# EAGLE design cubex_motherboard (EAGLE 6.5.0)
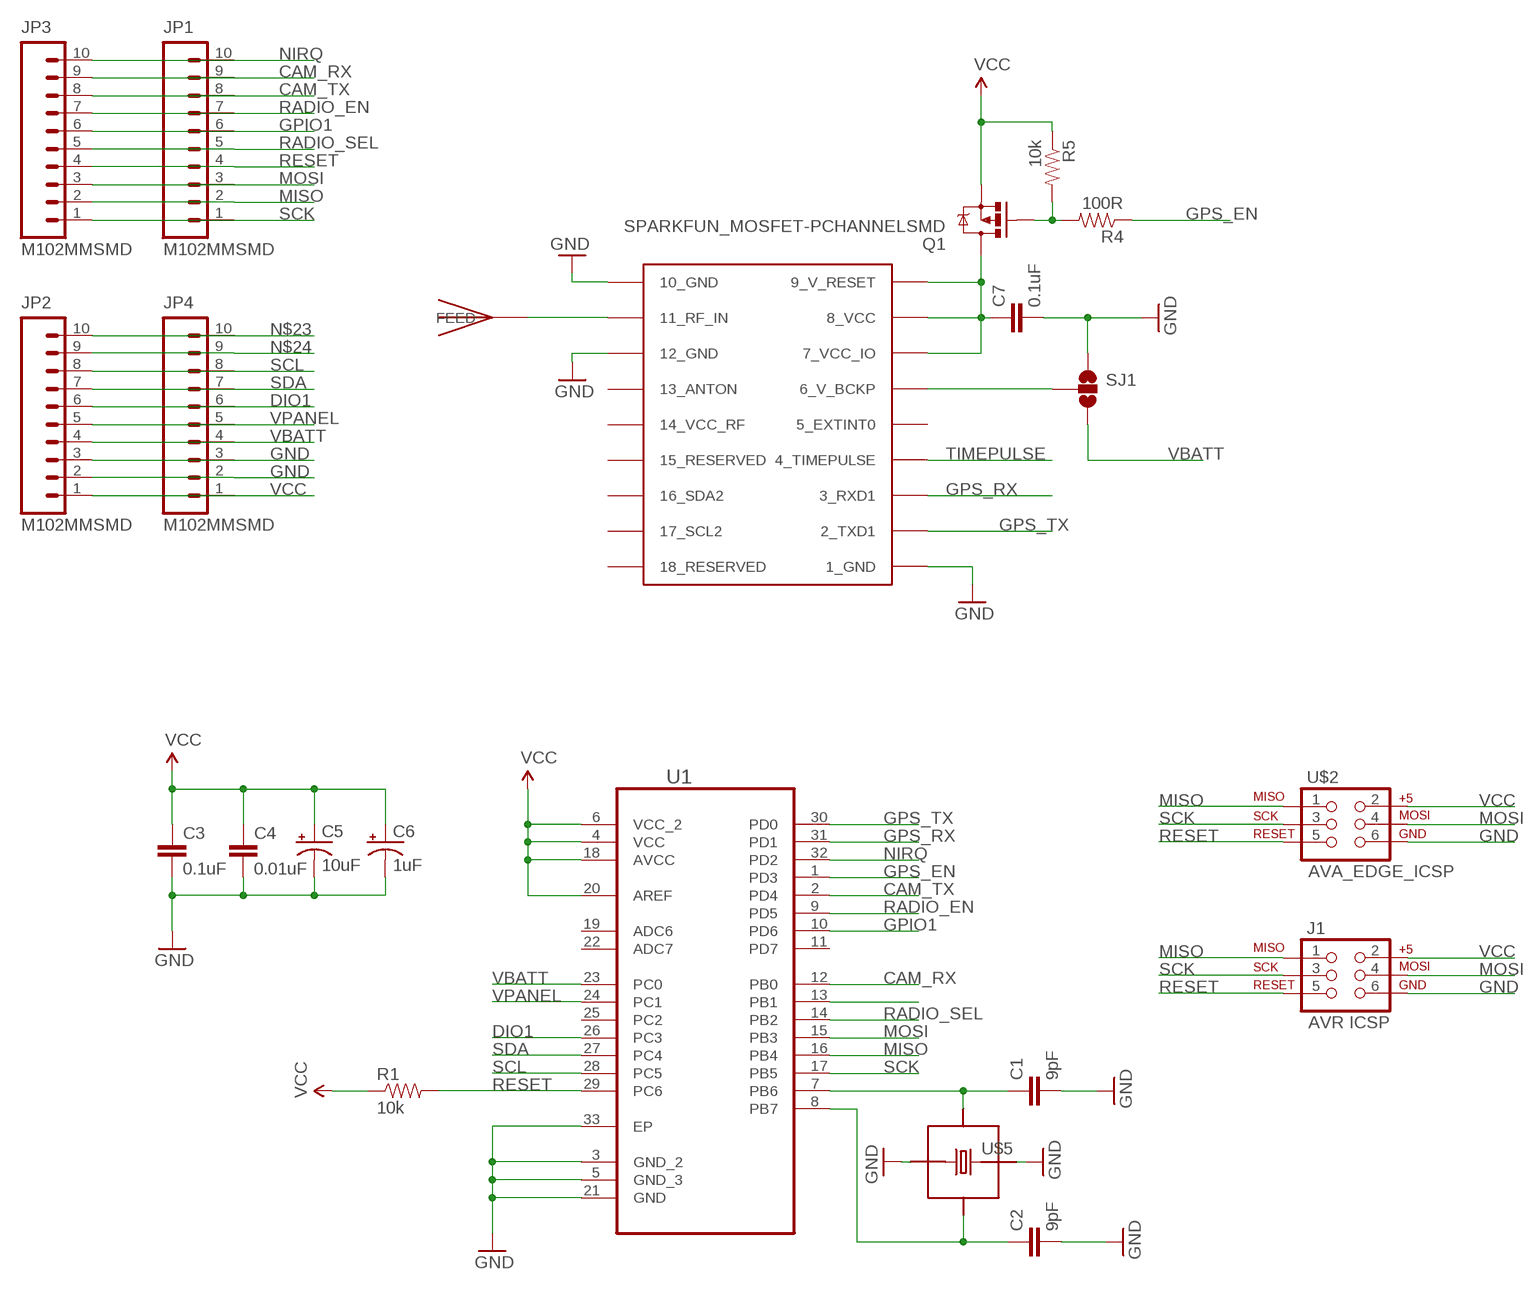
[diagram p0: schematic, sheet 1]

## Parts
C1  9pF  CAP0805  [0805]
C2  9pF  CAP0805  [0805]
C3  0.1uF  CAP0805  [0805]
C4  0.01uF  CAP0805  [0805]
C5  10uF  CAP_POL1206  [EIA3216]
C6  1uF  CAP_POL1206  [EIA3216]
C7  0.1uF  SPARKFUN_CAP0805  [SPARKFUN_0805]
J1  AVR ICSP  SPARKFUN_AVR_SPI_PRG_6NS  [SPARKFUN_2X3-NS]
JP1  M102MMSMD  [1X10-2MM-SMD]
JP2  M102MMSMD  [1X10-2MM-SMD]
JP3  M102MMSMD  [1X10-2MM-SMD]
JP4  M102MMSMD  [1X10-2MM-SMD]
Q1  SPARKFUN_MOSFET-PCHANNELSMD  [SPARKFUN_SOT23-3]
R1  10k  RESISTOR0805-RES  [0805]
R4  100R  SPARKFUN_RESISTOR0805-RES  [SPARKFUN_0805]
R5  10k  SPARKFUN_RESISTOR0805-RES  [SPARKFUN_0805]
SJ1  SPARKFUN_SOLDERJUMPER_2WAYT  [SPARKFUN_SJ_2]
U1  AVA_ATMEGA328P-MU  [AVA_QFN50P500X500X100-33N]
U$2  AVA_EDGE_ICSP  [AVA_EDGE_MOUNTED_ICSP]
U$3  AVA_JTI_ANTENNA-1575AT43A40  [AVA_JTI_ANTENNA-1575AT43A40]
U$4  AVA_UBLOX_MAX-6  [AVA_UBLOX_MAX-6]
U$5  AVA_EPSON_FA-20H_CRYSTAL  [AVA_EPSON-FA-20H-CRYSTAL]

## Nets
CAM_RX: JP1.9 JP3.9 U1.12(PB0)
CAM_TX: JP1.8 JP3.8 U1.2(PD4)
DIO1: JP2.6 JP4.6 U1.26(PC3)
GND: C1.2 C2.2 C3.2 C4.2 C5.C(-) C6.C(-) C7.2 J1.6 JP2.2 JP2.3 JP4.2 JP4.3 SJ1.1 U1.3(GND_2) U1.5(GND_3) U1.21(GND) U1.33(EP) U$2.6 U$4.1_GND U$4.10_GND U$4.12_GND U$5.1 U$5.3
GPIO1: JP1.6 JP3.6 U1.10(PD6)
GPS_EN: R4.1 U1.1(PD3)
GPS_RX: U1.31(PD1) U$4.3_RXD1
GPS_TX: U1.30(PD0) U$4.2_TXD1
MISO: J1.1 JP1.2 JP3.2 U1.16(PB4) U$2.1
MOSI: J1.4 JP1.3 JP3.3 U1.15(PB3) U$2.4
N$2: U1.13(PB1)
N$3: C7.1 Q1.3(D) U$4.7_VCC_IO U$4.8_VCC U$4.9_V_RESET
N$4: SJ1.2 U$4.6_V_BCKP
N$6: Q1.1(G) R4.2 R5.2
N$9: U$3.FEED U$4.11_RF_IN
N$10: C1.1 U1.7(PB6) U$5.4
N$11: C2.1 U1.8(PB7) U$5.2
N$23: JP2.10 JP4.10
N$24: JP2.9 JP4.9
NIRQ: JP1.10 JP3.10 U1.32(PD2)
RADIO_EN: JP1.7 JP3.7 U1.9(PD5)
RADIO_SEL: JP1.5 JP3.5 U1.14(PB2)
RESET: J1.5 JP1.4 JP3.4 R1.2 U1.29(PC6) U$2.5
SCK: J1.3 JP1.1 JP3.1 U1.17(PB5) U$2.3
SCL: JP2.8 JP4.8 U1.28(PC5)
SDA: JP2.7 JP4.7 U1.27(PC4)
TIMEPULSE: U$4.4_TIMEPULSE
VBATT: JP2.4 JP4.4 SJ1.3 U1.23(PC0)
VCC: C3.1 C4.1 C5.A(+) C6.A(+) J1.2 JP2.1 JP4.1 Q1.2(S) R1.1 R5.1 U1.4(VCC) U1.6(VCC_2) U1.18(AVCC) U1.20(AREF) U$2.2
VPANEL: JP2.5 JP4.5 U1.24(PC1)
Unconnected: U1.11(PD7) U1.19(ADC6) U1.22(ADC7) U1.25(PC2) U$4.5_EXTINT0 U$4.13_ANTON U$4.14_VCC_RF U$4.15_RESERVED U$4.16_SDA2 U$4.17_SCL2 U$4.18_RESERVED

## Library data of the parts
C1-C4 = SparkFun:CAP: Capacitor Standard 0603 ceramic capacitor, and 0.1" leaded capacitor.
C5 C6 = SparkFun:CAP_POL: Capacitor Polarized These are standard SMD and PTH capacitors. Normally 10uF, 47uF, and 100uF in electrolytic and tantalum varieties. Always verify the external diameter of the through hole cap, it varies with capacity, voltage, and manufacturer. The EIA devices should be standard.
C7 = picoAVA-R9:SPARKFUN_CAP: Capacitor Standard 0603 ceramic capacitor, and 0.1" leaded capacitor.
J1 = picoAVA-R8:SPARKFUN_AVR_SPI_PRG_6: AVR ISP 6 Pin This is the reduced ISP connector for AVR programming. Common on Arduino. This footprint will take up less PCB space and can be used with a 10-pin to 6-pin adapter such as SKU: BOB-08508
JP1-JP4 = SparkFun:M10: Header 10 Standard 10-pin 0.1" header. Use with straight break away headers (SKU : PRT-00116), right angle break away headers (PRT-00553), swiss pins (PRT-00743), machine pins (PRT-00117), and female headers (PRT-00115).
Q1 = picoAVA-R9:SPARKFUN_MOSFET-PCHANNEL
R1 = SparkFun:RESISTOR: Resistor Basic schematic elements and footprints for 0603, 1206, and PTH resistors.
R4 R5 = picoAVA-R9:SPARKFUN_RESISTOR: Resistor Basic schematic elements and footprints for 0603, 1206, and PTH resistors.
SJ1 = picoAVA-R9:SPARKFUN_SOLDERJUMPER_2WAY: Solder Jumper 2 way solder jumper
U1 = picoAVA-R8:AVA_ATMEGA328P-MU: Programmable Flash; MPN: ATMEGA328P-MU; OC_FARNELL: 1748522; OC_NEWARK: 26R2526; PACKAGE: QFN-32; SUPPLIER: Atmel
U$2 = picoAVA-R9:AVA_EDGE_ICSP
U$3 = picoAVA-R9:AVA_JTI_ANTENNA-1575AT43A40
U$4 = picoAVA-R9:AVA_UBLOX_MAX-6: UBLOX MAX-6
U$5 = picoAVA-R9:AVA_EPSON_FA-20H_CRYSTAL

## Board
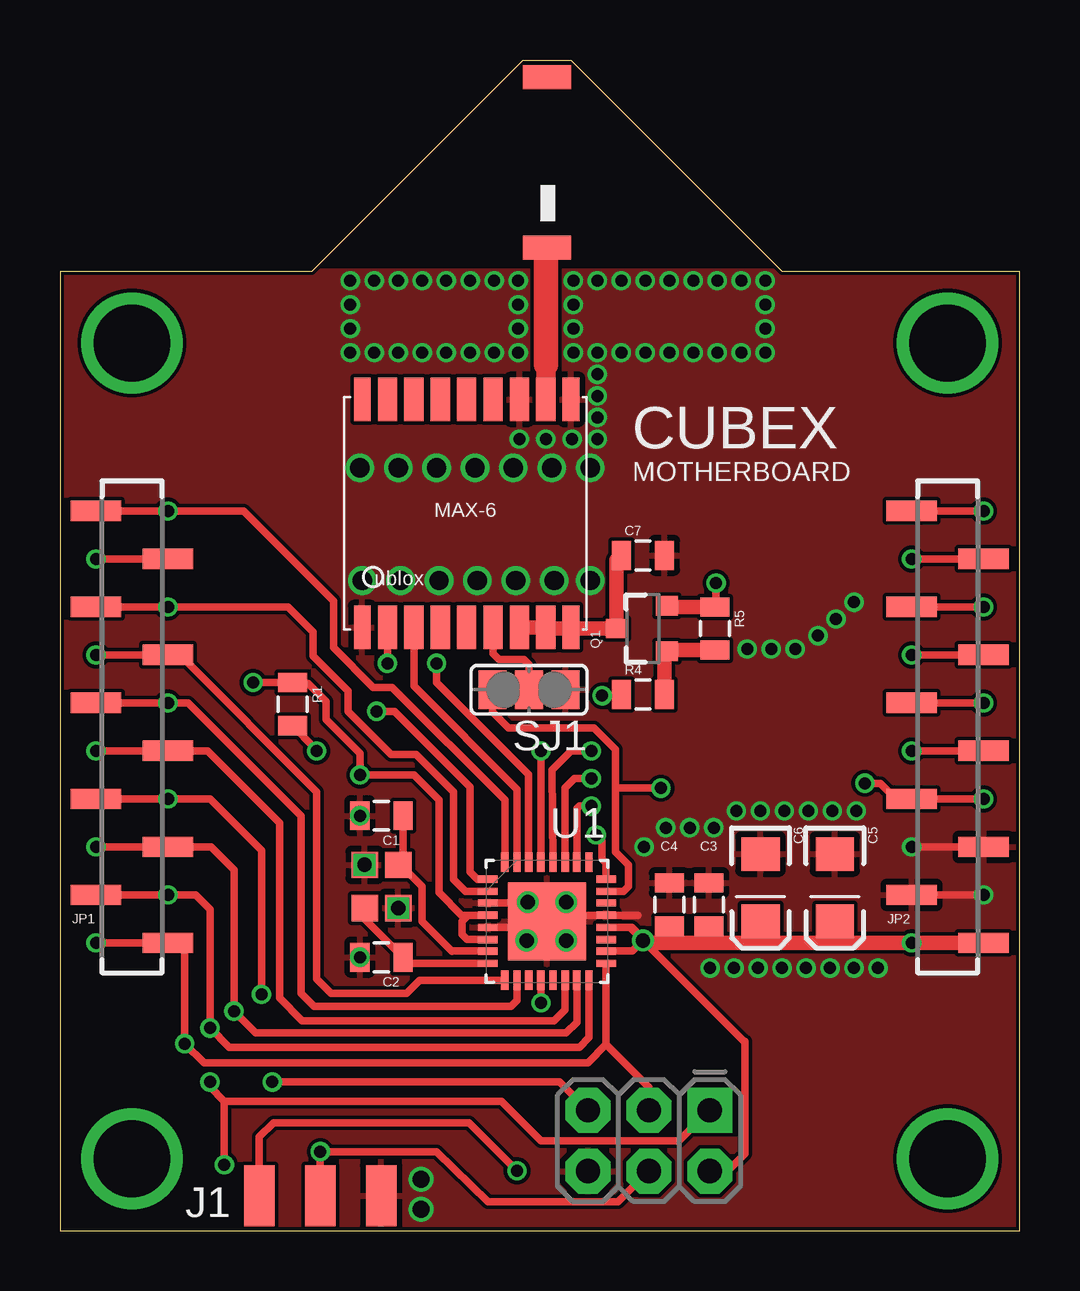
[diagram p1: board, top side]
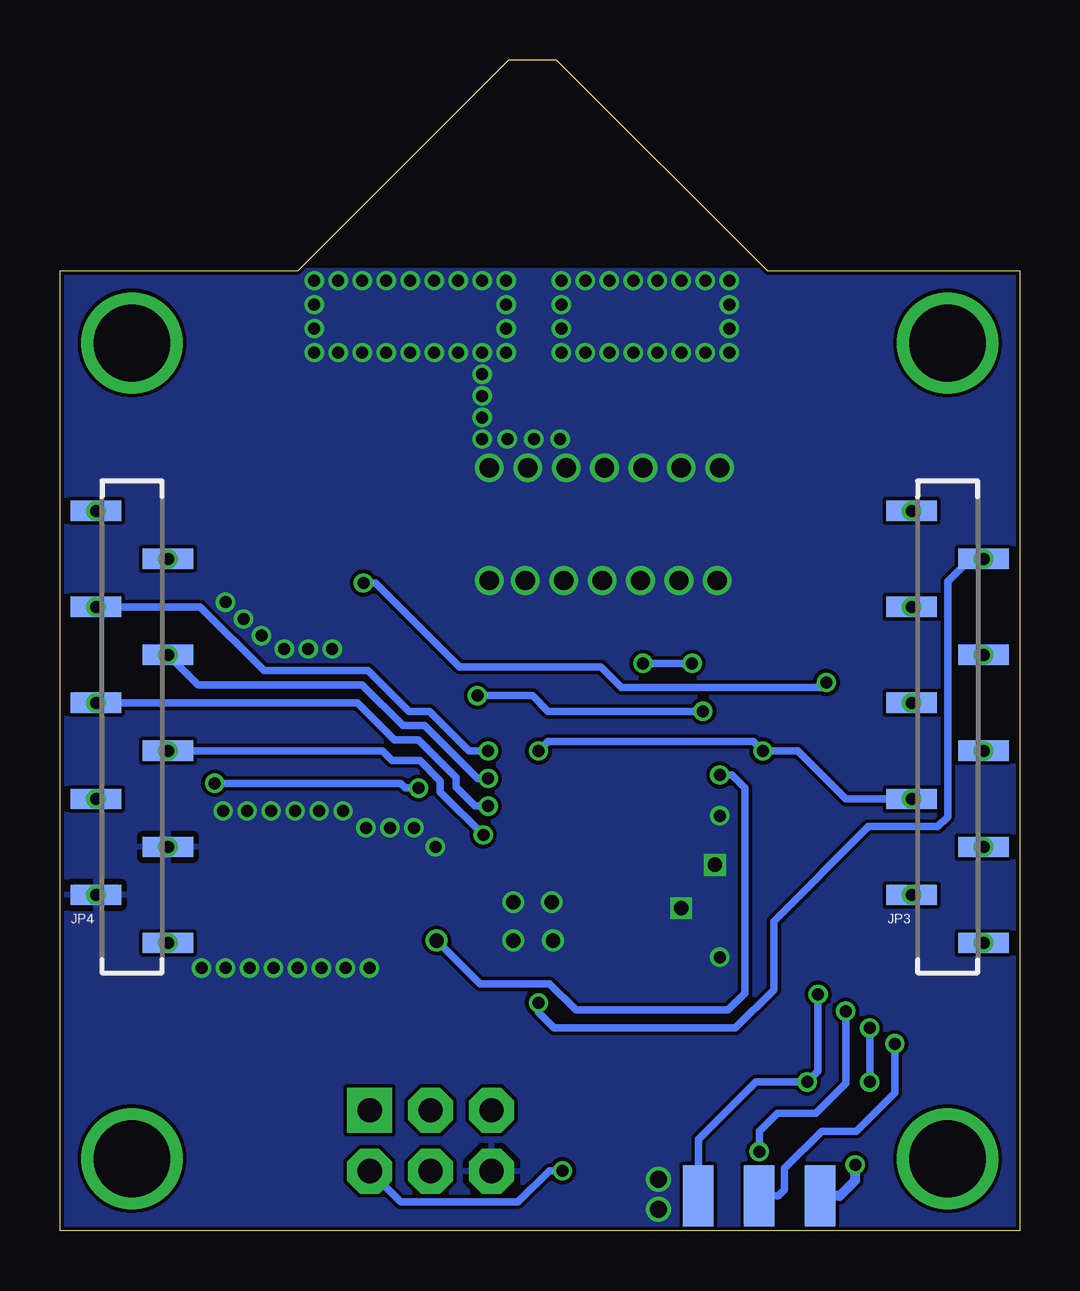
[diagram p2: board, bottom side, seen from below]

Size 40 x 48.8 mm. Coordinates in mm from the lower left corner, seen from the top.
Outline: 0,0 40,0 40,40 30.1,40 21.3,48.8 19.3,48.8 10.5,40 0,40 0,0
Copper layers (1*16): Top 0.035mm / dielectric 1.5mm / Bottom 0.035mm
Design rules "hackvana": minimum track width 6mil, minimum drill 0.3mm, track to track 6mil, track to pad 6mil, pad to pad 6mil, via to via 6mil, smd to smd 0mil, copper to edge 6mil, drill to drill 6mil, minimum pad ring 10mil, minimum via ring 6mil, stop-mask expansion 2mil, vias tented up to drill 100mil, thermal gap 10mil

### Footprints (pad centres in the part's own frame; a part is rotated, then mirrored left to right if it is on the bottom)
0805 = smd 0.8 x 1.2: 1 -0.9,0; 2 0.9,0
EIA3216 = smd 1.4 x 1.6: A 1.4,0; C -1.4,0
SPARKFUN_0805 = smd 0.8 x 1.2: 1 -0.9,0; 2 0.9,0
SPARKFUN_2X3-NS = drill 1.016 pad 1.88 square: 1 -2.54,-1.27 | drill 1.016 pad 1.88 octagon: 2 -2.54,1.27; 3 0,-1.27; 4 0,1.27; 5 2.54,-1.27; 6 2.54,1.27
1X10-2MM-SMD = smd 0.85 x 2.1: 1 0,-1.5; 2 2,1.5; 3 4,-1.5; 4 6,1.5; 5 8,-1.5; 6 10,1.5; 7 12,-1.5; 8 14,1.5; 9 16,-1.5; 10 18,1.5
SPARKFUN_SOT23-3 = smd 0.8 x 0.9: 1 -0.95,-1; 2 0.95,-1; 3 0,1.1
SPARKFUN_SJ_2 = smd 1.168 x 1.6: 1 -1.524,0; 2 0,0; 3 1.524,0
AVA_QFN50P500X500X100-33N = smd 0.813 x 0.305: 1 -2.464,1.753; 2 -2.464,1.245; 3 -2.464,0.762; 4 -2.464,0.254; 5 -2.464,-0.254; 6 -2.464,-0.762; 7 -2.464,-1.245; 8 -2.464,-1.753; 17 2.464,-1.753; 18 2.464,-1.245; 19 2.464,-0.762; 20 2.464,-0.254; 21 2.464,0.254; 22 2.464,0.762; 23 2.464,1.245; 24 2.464,1.753 | smd 0.305 x 0.813: 9 -1.753,-2.464; 10 -1.245,-2.464; 11 -0.762,-2.464; 12 -0.254,-2.464; 13 0.254,-2.464; 14 0.762,-2.464; 15 1.245,-2.464; 16 1.753,-2.464; 25 1.753,2.464; 26 1.245,2.464; 27 0.762,2.464; 28 0.254,2.464; 29 -0.254,2.464; 30 -0.762,2.464; 31 -1.245,2.464; 32 -1.753,2.464 | smd 3.251 x 3.251: 33 0,0
AVA_EDGE_MOUNTED_ICSP = smd 1.27 x 2.54 bottom: 1 -2.54,0; 3 0,0; 5 2.54,0 | smd 1.27 x 2.54: 2 -2.54,0; 4 0,0; 6 2.54,0
AVA_JTI_ANTENNA-1575AT43A40 = smd 1 x 2: FEED -3.175,0; NC 3.925,0
AVA_UBLOX_MAX-6 = smd 1.8 x 0.7: 1_GND 4.95,-4.4; 9_V_RESET 4.95,4.3; 10_GND -4.55,4.3; 18_RESERVED -4.55,-4.4 | smd 1.8 x 0.8: 2_TXD1 4.95,-3.35; 3_RXD1 4.95,-2.25; 4_TIMEPULSE 4.95,-1.15; 5_EXTINT0 4.95,-0.05; 6_V_BCKP 4.95,1.05; 7_VCC_IO 4.95,2.15; 8_VCC 4.95,3.25; 11_RF_IN -4.55,3.25; 12_GND -4.55,2.15; 13_ANTON -4.55,1.05; 14_VCC_RF -4.55,-0.05; 15_RESERVED -4.55,-1.15; 16_SDA2 -4.55,-2.25; 17_SCL2 -4.55,-3.35
AVA_EPSON-FA-20H-CRYSTAL = smd 1.1 x 1.1: 1 -0.9,-0.7; 2 0.9,-0.7; 3 0.9,0.7; 4 -0.9,0.7

### Placement (x,y rotation side)
C1  13.4,17.3 180 top
C2  13.4,11.4 180 top
C3  27.05,13.6 90 top
C4  25.4,13.6 90 top
C5  32.3,14.3 270 top
C6  29.2,14.3 270 top
C7  24.3,28.15 0 top
J1  24.55,3.75 180 top
JP1  3,12 90 top
JP2  37,12 90 top
JP3  3,12 90 bottom
JP4  37,12 90 bottom
Q1  24.3,25.1 90 top
R1  9.7,21.95 270 top
R4  24.3,22.35 0 top
R5  27.3,25.1 270 top
SJ1  19.55,22.55 180 top
U1  20.3,12.9 0 top
U$2  10.85,1.45 0 top
U$3  20.3,44.15 90 top
U$4  17,30.1 270 top
U$5  13.4,14.35 270 top

### Tracks (layer width: path | path; a pad name or v marks a point on that pad's centre or on a via)
CAM_RX  (via drill 0.5)
  Top 0.305: JP1.9 JP3.9 | U1.12 v20.05,9.5
  Bottom 0.305: v20.05,9.5 20.05,9.1 19.4,8.45 11.85,8.45 10.25,10.05 10.25,12.9 6.3,16.85 3.4,16.85 3,17.25 3,27.05 2.05,28 JP3.9
  other vias: 1.5,28
CAM_TX  (via drill 0.5)
  Top 0.305: JP1.8 JP3.8 9.5,26 10.55,24.95 10.55,23.95 12,22.5 12,21.65 13.8,19.85 14.85,19.85 16.4,18.3 16.4,14.65 16.91,14.14 U1.2
  other vias: 4.5,26
DIO1  (via drill 0.5)
  Top 0.305: JP2.6 JP4.6 | U1.26 21.55,17.59 21.65,17.7 v22.15,17.7
  Bottom 0.305: v22.15,17.7 22.7,17.7 23.5,18.5 23.5,18.9 25.05,20.45 26.05,20.45 27.6,22 JP4.6
  other vias: 38.5,22
GND  (via drill 0.5, 0.6, 0.7, 0.8)
  Top 0.305: U1.21 21.65,13.15 v21.1,13.7 | U1.33 v21.1,12.1 | U1.3 19.46,13.66 v19.5,13.7 | U1.5 18.9,12.65 v19.45,12.1 | JP2.2 JP4.2 | 22.95,13.15 24.1,13.15 | JP2.3 JP4.3
  other vias: 12.7,15.25 14.1,13.45 38.5,14 15.05,2.15 12.1,39.6 13.1,39.6 14.1,39.6 15.1,39.6 16.1,39.6 17.1,39.6 18.1,39.6 19.1,39.6 19.1,38.6 19.1,37.6 19.1,36.6 19.15,33 20.25,33 21.35,33 21.4,36.6 21.4,37.6 21.4,38.6 21.4,39.6 22.4,39.6 23.4,39.6 24.4,39.6 25.4,39.6 26.4,39.6 27.4,39.6 28.4,39.6 29.4,39.6 12.1,38.6 12.1,37.6 12.1,36.6 13.1,36.6 14.1,36.6 15.1,36.6 16.1,36.6 18.1,36.6 17.1,36.6 22.4,33 22.4,33.9 22.4,34.8 22.4,35.7 22.4,36.6 23.4,36.6 24.4,36.6 25.4,36.6 26.4,36.6 27.4,36.6 28.4,36.6 29.4,36.6 29.4,37.6 29.4,38.6 12.5,11.4 12.5,17.3 24.35,16 25.25,16.8 26.25,16.8 27.25,16.8 28.2,17.5 29.2,17.5 30.2,17.5 31.2,17.5 32.2,17.5 33.2,17.5 34.1,10.95 33.1,10.95 32.1,10.95 31.1,10.95 30.1,10.95 29.1,10.95 28.1,10.95 27.1,10.95 12.5,31.8 14.1,31.8 15.7,31.8 17.3,31.8 18.9,31.8 20.5,31.8 22.1,31.8 22.1,27.1 20.6,27.1 19,27.1 17.4,27.1 15.8,27.1 14.2,27.1 12.6,27.1 35.5,16 15.05,0.9 28.65,24.25 29.65,24.25 30.65,24.25 31.6,24.8 32.35,25.5 33.1,26.2
  pour Top: 0,40 40,40 40,0 0,0
  pour Bottom: 0,40 40,40 40,0 0,0
GPIO1  (via drill 0.5)
  Top 0.305: JP1.6 JP3.6 5.35,22 10.05,17.3 10.05,9.9 10.6,9.35 18.8,9.35 19.05,9.61 U1.10
  other vias: 4.5,22
GPS_EN  (via drill 0.5)
  Top 0.305: U1.1 17.4,14.65 17.1,14.95 17.1,18.5 13.95,21.65 v13.2,21.65 | v22.6,22.3 23.35,22.3 R4.1
  Bottom 0.305: v13.2,21.65 19.65,21.65 20.3,22.3 v22.6,22.3
GPS_RX
  Top 0.305: U$4.3_RXD1 14.75,22.7 19.05,18.39 U1.31
GPS_TX  (via drill 0.5)
  Top 0.305: U$4.2_TXD1 v13.65,23.65 | U1.30 19.54,19.01 15.7,22.85 v15.7,23.65
  Bottom 0.305: v13.65,23.65 v15.7,23.65
MISO  (via drill 0.5)
  Top 0.305: JP1.2 JP3.2 5.65,14 6.25,13.4 v6.25,8.45 7.05,7.65 21.65,7.65 22.05,8.05 U1.16 | J1.1 27.07,5.02 25.8,3.75 20.05,3.75 18.4,5.4 6.85,5.4 | v6.25,6.2 6.25,6 6.85,5.4 | v6.85,2.75 6.85,5.4
  Bottom 0.305: v6.25,6.2 v6.25,8.45 | v6.85,2.75 v6.86,2.75
  Bottom 0.406: v6.86,2.75 6.86,2.09 7.5,1.45 U$2.1
  other vias: 4.5,14
MOSI  (via drill 0.5)
  Top 0.305: U1.15 21.55,8.7 21.1,8.25 8.15,8.25 v7.25,9.15 7.25,15.05 6.3,16 JP1.3 JP3.3 | J1.4 23.27,1.2 17.85,1.2 15.7,3.3 v10.85,3.3 U$2.4
  Bottom 0.305: v7.25,9.15 7.25,6.15 8.5,4.9 10.1,4.9 10.85,4.15 v10.85,3.3
  other vias: 1.5,16
N$3
  Top 0.61: U$4.7_VCC_IO U$4.8_VCC 20.3,25.1 21.25,25.1 | 21.25,25.1 U$4.9_V_RESET | C7.1 23.2,27.95 Q1.3 21.25,25.1
N$4
  Top 0.305: U$4.6_V_BCKP 18.05,24.05 18.3,23.8 19.35,23.8 19.55,23.6 SJ1.2
N$5  (via drill 3.2)
  other vias: 3,3
N$6
  Top 0.61: R5.2 25.35,24.2 Q1.1 25.2,24.05 R4.2
N$7  (via drill 3.2)
  other vias: 37,3
N$8  (via drill 3.2)
  other vias: 37,37
N$9
  Top 0.813: U$4.11_RF_IN 20.25,36.1
  Top 1.016: 20.25,36.1 20.25,40.58 U$3.FEED
N$10
  Top 0.305: C1.1 14.3,15.45 U$5.4 14.2,15.25 15.1,14.35 15.1,12.9 16.35,11.65 16.36,11.65 U1.7
N$11
  Top 0.305: 12.5,13.2 12.5,13.25 U$5.2 12.7,13 C2.1 14.55,11.15 U1.8
N$12  (via drill 3.2)
  other vias: 3,37
N$23  (via drill 0.5)
  Top 0.305: JP2.10 JP4.10
  other vias: 38.5,30
N$24  (via drill 0.5)
  Top 0.305: JP2.9 JP4.9
  other vias: 35.5,28
NIRQ  (via drill 0.5)
  Top 0.305: U1.32 18.55,17.95 13.85,22.65 13.05,22.65 11.4,24.3 11.4,26.25 7.65,30 JP3.10 JP1.10
  other vias: 4.5,30
RADIO_EN  (via drill 0.5)
  Top 0.305: JP3.7 JP1.7 5,24 10.7,18.3 10.7,10.5 11.3,9.9 14.45,9.9 14.99,10.44 U1.9
  other vias: 1.5,24
RADIO_SEL  (via drill 0.5)
  Top 0.305: JP3.5 JP1.5 6.15,20 9.15,17 9.15,9.7 10.1,8.75 20.6,8.75 21.06,9.21 U1.14
  other vias: 1.5,20
RESET  (via drill 0.5)
  Top 0.305: U1.29 v20.05,20 | JP1.4 JP3.4 6.25,18 8.4,15.85 v8.4,9.85 | v8.85,6.2 20.83,6.2 J1.5 | v10.7,20 10.6,20.1 10.6,20.15 R1.2
  Bottom 0.305: v8.4,9.85 8.4,6.65 v8.85,6.2 11,6.2 13.39,3.81 U$2.5 | 21.99,5 J1.5 | JP3.4 7.25,18 9.25,20 v10.7,20 11.1,20.4 19.65,20.4 v20.05,20
  other vias: 4.5,18
SCK  (via drill 0.5)
  Top 0.305: U1.17 22.76,7.76 | 22.76,7.76 22,7 6,7 v5.2,7.8 5.2,11.8 5,12 JP1.1 JP3.1 | J1.3 24.55,5.98 22.76,7.76
  Bottom 0.305: 10.85,1.9 U$2.3 10.05,1.45 9.8,1.7 9.8,2.6 8.25,4.15 6.8,4.15 5.2,5.75 v5.2,7.8
  other vias: 1.5,12
SCL  (via drill 0.5)
  Top 0.305: JP2.8 JP4.8 | U1.28 20.5,19.2 21.3,20 v22.15,20
  Bottom 0.305: v22.15,20 22.95,20 24.6,21.65 25.45,21.65 27.15,23.35 31.5,23.35 34.15,26 JP4.8
  other vias: 38.5,26
SDA  (via drill 0.5)
  Top 0.305: JP2.7 JP4.7 | U1.27 21.06,18.46 21.45,18.85 v22.15,18.85
  Bottom 0.305: v22.15,18.85 22.6,18.85 24.8,21.05 25.7,21.05 27.4,22.75 34.25,22.75 JP4.7
  other vias: 35.5,24
VBATT  (via drill 0.5)
  Top 0.305: U1.23 23.5,14.14 23.7,14.35 23.7,15.25 23.15,15.8 23.15,18.5 | SJ1.3 18.02,21.63 18.7,20.95 22.25,20.95 23.15,20.05 23.15,18.5 | JP4.4 JP2.4 34.85,18 34.2,18.65 v33.55,18.65 | v25.05,18.45 23.2,18.45 23.15,18.5
  Bottom 0.305: v25.05,18.45 25.6,18.45 25.8,18.65 v33.55,18.65
  other vias: 38.5,18
VCC  (via drill 0.5, 0.6)
  Top 0.305: U1.6 16.96,12.14 16.75,12.35 16.75,12.9 16.9,13.05 | 16.9,13.05 17,13.15 U1.4 16.75,13.15 15.8,14.1 15.8,17.95 14.75,19 v12.5,19 12.5,19.9 11.1,21.3 11.1,22.05 10.35,22.8 9.75,22.8 R1.1 v8.05,22.85 | 16.9,13.05 16.85,13.05 | J1.2 27.83,2.48 28.55,3.2 28.55,7.9 28.5,7.9 v24.3,12.1 | U$2.2 8.31,3.91 8.9,4.5 17.05,4.5 v19.05,2.5 | U1.18 23.86,11.65 v24.3,12.1 | v24.3,12.1 24.35,12.15 23.85,12.65 U1.20 23.75,12.65 v24.3,12.1 | v27.35,27 27.35,26.05 R5.1
  Top 0.61: R5.1 25.35,26 Q1.2 | JP2.1 JP4.1 32.1,12 | 32.1,12 29.5,12 | 29.5,12 27,12 | 27,12 25.45,12 | C6.A 29.2,12.3 29.5,12 | C5.A 32.3,12.2 32.1,12 | C4.1 25.4,12.05 25.45,12 | C3.1 27.05,12.05 27,12 | 25.45,12 24.5,12 24.35,12.15
  Bottom 0.305: v19.05,2.5 19.6,2.5 20.9,1.2 25.81,1.2 J1.2 | v27.35,27 26.85,27 23.35,23.5 17.45,23.5 16.6,22.65 8.25,22.65 v8.05,22.85 | v12.5,19 12,19 11.45,18.45 11.45,9.9 12.15,9.2 18.5,9.2 19.6,10.3 22.5,10.3 v24.3,12.1
  other vias: 35.5,12
VPANEL  (via drill 0.5)
  Top 0.305: JP2.5 JP4.5 | U1.24 22.76,15.34 22.6,15.5 22.6,16.25 v22.35,16.5
  Bottom 0.305: JP4.5 26.55,20 26.15,19.6 25,19.6 24.15,18.75 24.15,18.3 v22.35,16.5
  other vias: 35.5,20

### Text on the board
tNames: CUBEX | MOTHERBOARD